# EAGLE design AS3364 waveform VCA 0402 DIL w two separate vcas v1.0-for design block (EAGLE 9.6.2)
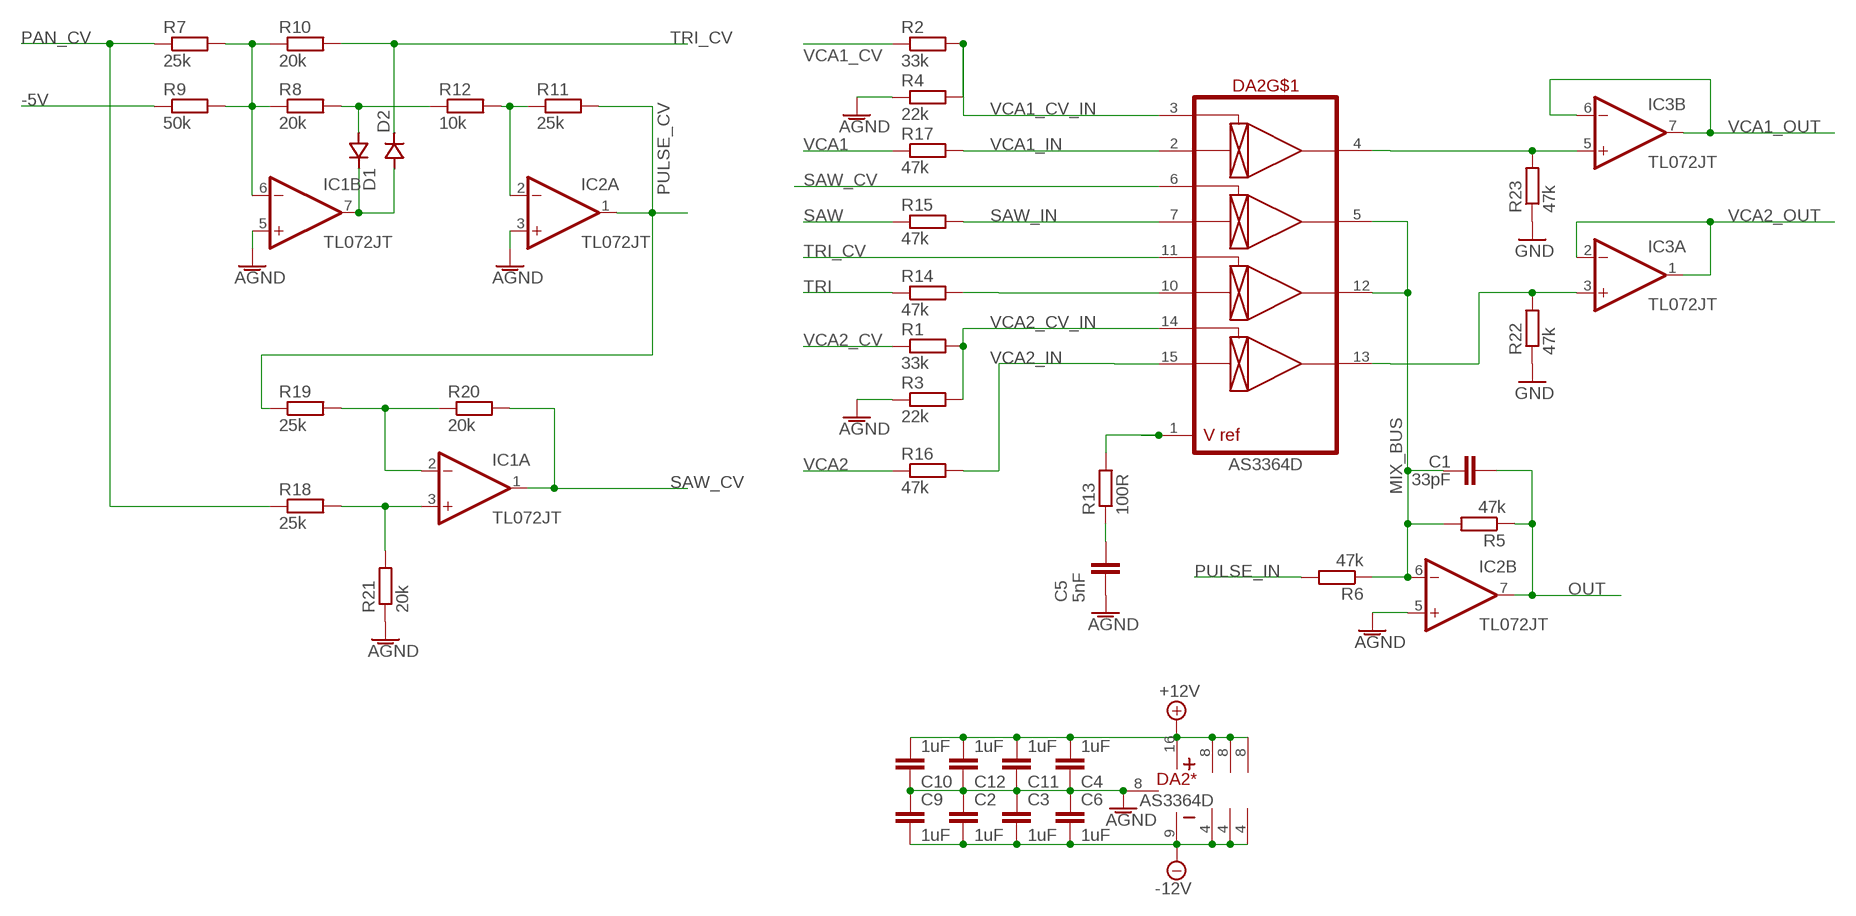
[diagram p0: schematic, sheet 1]

## Parts
C1  33pF  C-EU-J  [C0402-J]
C2  1uF  C-EU-J  [C0402-J]
C3  1uF  C-EU-J  [C0402-J]
C4  1uF  C-EU-J  [C0402-J]
C5  5nF  C-EU-J  [C0402-J]
C6  1uF  C-EU-J  [C0402-J]
C9  1uF  C-EU-J  [C0402-J]
C10  1uF  C-EU-J  [C0402-J]
C11  1uF  C-EU-J  [C0402-J]
C12  1uF  C-EU-J  [C0402-J]
D1  DIODESOD323  [SOD323J]
D2  DIODESOD323  [SOD323J]
DA2  AS3364D  [DIL16J]
IC1  TL072JT  [TSSOP8J]
IC2  TL072JT  [TSSOP8J]
IC3  TL072JT  [TSSOP8J]
R1  33k  R-EU_R0402  [R0402]
R2  33k  R-EU_R0402  [R0402]
R3  22k  R-EU_R0402  [R0402]
R4  22k  R-EU_R0402  [R0402]
R5  47k  R-EU_R0402  [R0402]
R6  47k  R-EU_R0402  [R0402]
R7  25k  R-EU_R0402  [R0402]
R8  20k  R-EU_R0402  [R0402]
R9  50k  R-EU_R0402  [R0402]
R10  20k  R-EU_R0402  [R0402]
R11  25k  R-EU_R0402  [R0402]
R12  10k  R-EU_R0402  [R0402]
R13  100R  R-EU_R0402  [R0402]
R14  47k  R-EU_R0402  [R0402]
R15  47k  R-EU_R0402  [R0402]
R16  47k  R-EU_R0402  [R0402]
R17  47k  R-EU_R0402  [R0402]
R18  25k  R-EU_R0402  [R0402]
R19  25k  R-EU_R0402  [R0402]
R20  20k  R-EU_R0402  [R0402]
R21  20k  R-EU_R0402  [R0402]
R22  47k  R-EU_R0402  [R0402]
R23  47k  R-EU_R0402  [R0402]

## Nets
+12V: C4.2 C10.2 C11.2 C12.2 DA2.16(*:V+) IC1.8(P:V+) IC2.8(P:V+) IC3.8(P:V+)
-5V: R9.1
-12V: C2.1 C3.1 C6.1 C9.1 DA2.9(*:V-) IC1.4(P:V-) IC2.4(P:V-) IC3.4(P:V-)
AGND: C2.2 C3.2 C4.1 C5.1 C6.2 C9.2 C10.1 C11.1 C12.1 DA2.8(*:GND) IC1.5(B:+IN) IC2.3(A:+IN) IC2.5(B:+IN) R3.1 R4.1 R21.1
GND: R22.1 R23.1
MIX_BUS: C1.2 DA2.5(OUT2) DA2.12(OUT3) IC2.6(B:-IN) R5.2 R6.1
N$2: DA2.1(VREF) R13.2
N$6: D1.1(C) D2.2(A) IC1.7(B:OUT)
N$8: IC1.6(B:-IN) R7.2 R8.1 R9.2 R10.1
N$11: IC1.3(A:+IN) R18.2 R21.2
N$14: C5.2 R13.1
N$15: IC1.2(A:-IN) R19.2 R20.1
N$18: IC2.2(A:-IN) R11.1 R12.2
N$19: D1.2(A) R8.2 R12.1
OUT: C1.1 IC2.7(B:OUT) R5.1
PAN_CV: R7.1 R18.1
PULSE_CV: IC2.1(A:OUT) R11.2 R19.1
PULSE_IN: R6.2
SAW: R15.1
SAW_CV: DA2.6(CV2) IC1.1(A:OUT) R20.2
SAW_IN: DA2.7(IN2) R15.2
TRI: R14.1
TRI_CV: D2.1(C) DA2.11(CV3) R10.2
TRI_IN: DA2.10(IN3) R14.2
VCA1: R17.1
VCA1_CV: R2.1
VCA1_CV_IN: DA2.3(CV1) R2.2 R4.2
VCA1_IN: DA2.2(IN1) R17.2
VCA1_OUT: IC3.6(B:-IN) IC3.7(B:OUT)
VCA1_PRE_OUT: DA2.4(OUT1) IC3.5(B:+IN) R23.2
VCA2: R16.1
VCA2_CV: R1.1
VCA2_CV_IN: DA2.14(CV4) R1.2 R3.2
VCA2_IN: DA2.15(IN4) R16.2
VCA2_OUT: IC3.1(A:OUT) IC3.2(A:-IN)
VCA2_PRE_OUT: DA2.13(OUT4) IC3.3(A:+IN) R22.2

## Library data of the parts
C1-C6 C9-C12 = joakim:C-EU-J: CAPACITOR, European symbol
D1 D2 = joakim:DIODE: DIODE; MPN: CDSOD323-T05C; OC_FARNELL: 1824860; OC_NEWARK: 79R6078
DA2 = joakim:AS3364: AS3364 quad linear VCA, CEM3360 style. CV is 0 to 2V Vcc-Vee = 26V max, so +/-12V or +15V/-9V
IC1-IC3 = joakim:TL072J: OP AMP
R1-R23 = rcl:R-EU_: RESISTOR, European symbol; SPICEPREFIX: R

## Board
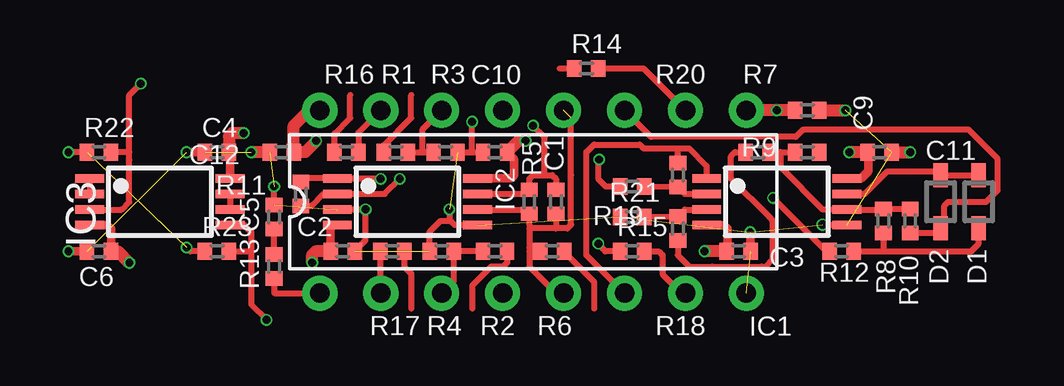
[diagram p1: board, top side]
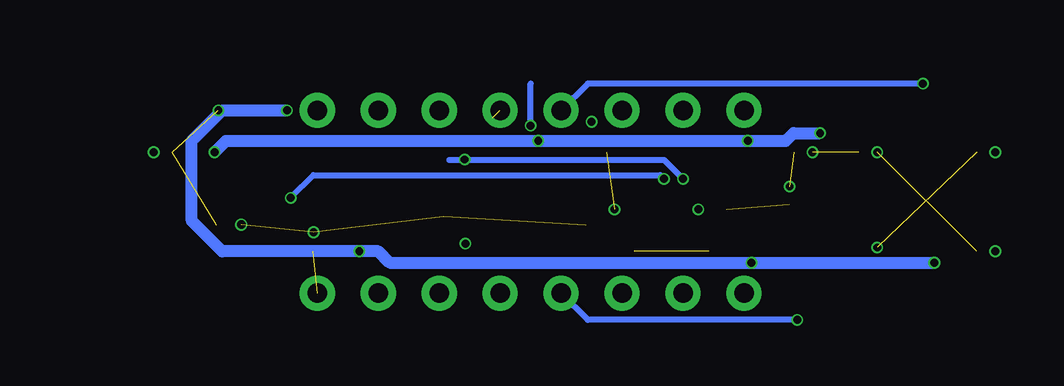
[diagram p2: board, bottom side, seen from below]

No outline drawn. Coordinates in mm, seen from the top.
Copper layers (1*16): Top 0.035mm / dielectric 1.6mm / Bottom 0.035mm
Design rules "jlcpcb-2layers": minimum track width 5mil, minimum drill 0.3mm, track to track 5mil, track to pad 5mil, pad to pad 5mil, via to via 5mil, smd to smd 5mil, copper to edge 0.2mm, drill to drill 6mil, minimum pad ring 10mil, minimum via ring 3mil, stop-mask expansion 4mil, vias tented up to drill 0mil, thermal gap 10mil

### Footprints (pad centres in the part's own frame; a part is rotated, then mirrored left to right if it is on the bottom)
C0402-J = smd 0.6 x 0.7: 1 -0.5,0; 2 0.5,0
SOD323J = smd 1 x 0.6: 1 -1.1,0; 2 1.1,0
DIL16J = drill 0.813: 1 -8.89,-3.81; 2 -6.35,-3.81; 3 -3.81,-3.81; 4 -1.27,-3.81; 5 1.27,-3.81; 6 3.81,-3.81; 7 6.35,-3.81; 8 8.89,-3.81; 9 8.89,3.81; 10 6.35,3.81; 11 3.81,3.81; 12 1.27,3.81; 13 -1.27,3.81; 14 -3.81,3.81; 15 -6.35,3.81; 16 -8.89,3.81
TSSOP8J = smd 1.2 x 0.35: 1 -2.925,0.975; 2 -2.925,0.325; 3 -2.925,-0.325; 4 -2.925,-0.975; 5 2.925,-0.975; 6 2.925,-0.325; 7 2.925,0.325; 8 2.925,0.975
R0402 = smd 0.6 x 0.7: 1 -0.5,0; 2 0.5,0

### Placement (x,y rotation side)
C1  21.27,4.76 270 top
C2  12.38,2.7 0 top
C3  28.89,2.7 0 top
C4  7.14,6.83 0 top
C5  9.53,4.13 270 top
C6  2.22,2.7 180 top
C9  31.75,8.57 0 top
C10  18.73,6.83 0 top
C11  34.77,6.83 180 top
C12  9.84,6.83 0 top
D1  38.89,4.76 270 top
D2  37.31,4.76 90 top
DA2  20.32,4.76 0 top
IC1  30.48,4.76 0 top
IC2  15.08,4.76 0 top
IC3  4.76,4.76 0 top
R1  14.61,6.83 0 top
R2  18.73,2.7 180 top
R3  16.67,6.83 180 top
R4  16.51,2.7 0 top
R5  20.16,4.76 270 top
R6  21.11,2.7 0 top
R7  29.69,6.83 0 top
R8  34.92,3.97 270 top
R9  31.75,6.83 180 top
R10  36.04,3.97 270 top
R11  10.64,5.08 90 top
R12  33.18,2.7 180 top
R13  9.53,2.06 270 top
R14  22.54,10.32 0 top
R15  24.45,2.7 0 top
R16  12.54,6.83 0 top
R17  14.45,2.7 180 top
R18  26.35,3.65 90 top
R19  24.45,5.4 0 top
R20  26.35,5.87 90 top
R21  24.45,4.13 0 top
R22  2.22,6.83 0 top
R23  7.14,2.7 0 top

### Tracks (layer width: path | path; a pad name or v marks a point on that pad's centre or on a via)
+12V  (via drill 0.33)
  Top 0.356: IC1.8 33.99,5.74 34.29,6.03 34.29,6.8 C11.2 | C4.2 7.69,6.78 IC3.8 | IC2.8 19.39,5.74 19.53,5.87 19.53,6.53 C10.2
  Top 0.508: C10.2 19.71,7.3 v20,7.3 | v11.27,7.3 11.27,7.28 10.82,6.83 C12.2 10.34,7.94 10.98,8.57 DA2.16 | C11.2 v33.5,6.83 | v8.26,7.62 7.78,7.62 7.64,7.49 C4.2
  Bottom 0.508: v33.5,6.83 33.02,7.3 v20,7.3 18.1,7.3 v11.27,7.3 9.68,7.3 9.37,7.62 v8.26,7.62
-12V  (via drill 0.33)
  Top 0.356: C2.1 11.88,3.33 11.88,3.79 IC2.4 | IC1.4 28.28,3.79 28.42,3.65 28.42,2.72 C3.1 | IC3.4 2.56,3.79 2.72,3.63 C6.1
  Top 0.508: DA2.9 C9.1 v30.48,8.57 | C2.1 11.25,2.7 11.11,2.56 v11.11,2.22 | C3.1 v27.46,2.7 | v3.49,2.22 3.02,2.7 C6.1
  Bottom 0.508: 26.67,2.7 26.19,2.22 v11.11,2.22 v3.49,2.22 | 26.67,2.7 v27.46,2.7 | 26.67,2.7 v27.46,2.7 | v27.46,2.7 33.18,2.7 34.45,3.97 34.45,7.3 33.18,8.57 v30.48,8.57
AGND  (via drill 0.33, 0.35)  (12 unrouted)
  Top 0.254: IC1.5 32.41,3.79 v32.38,3.81 | C5.1 v9.53,5.4 | IC2.5 17.05,3.79 16.83,4.01 v16.83,4.45 | IC2.3 v13.34,4.45 13.34,3.15 C2.2 | R4.1 16.01,3.52 16.46,3.97 16.83,3.97 | R3.1 17.78,6.83 | 17.78,6.83 C10.1 | 17.78,6.83 v17.78,8.1
  Top 0.356: C3.2 29.37,2.72 v29.37,3.49 | C4.1 v5.87,6.83 | C6.2 v0.95,2.7
  Top 0.508: C9.2 v33.34,8.57 | C11.1 v36.04,6.83 | C12.1 v8.57,6.83
GND  (via drill 0.33)  (1 unrouted)
  Top 0.254: R22.1 v0.95,6.83 | R23.1 6.03,2.7 v5.87,2.86
MIX_BUS  (1 unrouted)
  Top 0.254: 21.27,3.65 21.75,3.65 21.91,3.81 21.91,5.87 21.91,8.26 | 21.27,3.65 20.16,3.65 | IC2.6 19.99,4.44 R5.2 20.16,3.81 20.16,3.65 | C1.2 21.27,3.65 | 20.16,3.65 20.16,2.86 20.16,2.7 | 20.16,2.7 R6.1 | 20.16,2.7 20.16,2.06 21.27,0.95 DA2.5
N$2
  Top 0.254: DA2.1 9.53,0.95 R13.2
N$6
  Top 0.254: IC1.7 34.14,5.09 35.08,6.03 37.14,6.03 D2.2 D1.1
N$8
  Top 0.254: IC1.6 32.39,4.44 30.64,6.19 30.64,6.83 | R7.2 30.64,6.83 | 30.64,6.83 R9.2 | 33.44,4.47 IC1.6 | IC1.6 34.89,4.44 R8.1 R10.1
N$11
  Top 0.254: 27.56,4.45 IC1.3 26.64,4.44 R18.2 R21.2
N$14
  Top 0.254: R13.1 C5.2
N$15
  Top 0.254: 27.56,5.08 IC1.2 26.64,5.09 R20.1 R19.2
N$18  (via drill 0.33)
  Top 0.254: R11.1 11.09,4.58 11.6,5.09 IC2.2 14.14,5.09 v14.76,5.71 | v30.32,4.92 32.54,2.7 R12.2
  Bottom 0.254: v30.32,4.92 29.37,5.87 14.92,5.87 v14.76,5.71
N$19
  Top 0.254: R8.2 34.92,2.7 | R12.1 34.92,2.7 | D1.2 38.89,3.02 38.58,2.7 34.92,2.7
OUT  (via drill 0.33)
  Top 0.254: IC2.7 19.99,5.09 R5.1 20.16,5.71 20.32,5.87 20.8,5.87 | 20.8,5.87 21.11,5.87 21.27,5.71 C1.1 | v20.32,7.94 20.8,7.46 20.8,5.87
  Bottom 0.254: v20.32,7.94 20.32,9.68
PAN_CV
  Top 0.254: R18.1 26.35,2.54 26.83,2.06 27.78,2.06 29.84,2.06 30,2.06 30.32,2.38 30.32,3.97 30.16,4.13 28.57,5.71 28.57,6.67 28.73,6.83 R7.1
PULSE_CV  (via drill 0.33)
  Top 0.254: R11.2 10.79,5.74 IC2.1 13.95,5.74 v13.97,5.71 | R19.1 23.35,5.4 23.03,5.73 23.03,6.48 v23.07,6.52
  Bottom 0.254: v13.97,5.71 14.76,6.51 19.84,6.51 23.71,6.51 23.09,6.51 v23.07,6.52
PULSE_IN
  Top 0.254: R6.2 21.61,2.67 22.86,1.43 22.86,0.32
SAW  (via drill 0.33)
  Top 0.254: R15.1 23.34,2.7 23.02,3.02 v23.04,3.02
SAW_CV
  Top 0.254: 27.53,5.71 IC1.1 27.55,6.26 26.83,6.99 26.35,6.99 | DA2.6 22.54,2.54 22.54,6.35 22.54,6.83 22.86,7.14 24.77,7.14 24.92,6.99 26.35,6.99 | R20.2 26.35,6.99
SAW_IN
  Top 0.254: R15.2 25.56,2.7 25.72,2.54 25.72,1.75 26.51,0.95 DA2.7
TRI
  Top 0.254: 21.43,10.32 R14.1
TRI_CV
  Top 0.254: R10.2 37.11,3.47 D2.1 37.47,3.82 37.47,4.6 37.62,4.76 39.21,4.76 39.69,5.24 39.69,6.54 38.45,7.78 31.59,7.78 31.27,7.46 25.24,7.46 DA2.11
TRI_IN
  Top 0.254: R14.2 24.92,10.32 DA2.10
VCA1
  Top 0.254: R17.1 14.95,2.06 15.24,1.77 15.24,0.32
VCA1_CV
  Top 0.254: R2.1 19.23,2.22 19.07,2.06 18.57,2.06 17.78,1.27 17.78,0.32
VCA1_CV_IN
  Top 0.254: R2.2 R4.2 17.01,1.45 DA2.3
VCA1_IN
  Top 0.254: R17.2 13.95,0.98 DA2.2
VCA1_OUT
  Top 0.254: IC3.7 IC3.6
VCA1_PRE_OUT  (via drill 0.33)
  Top 0.254: 7.71,3.81 IC3.5 8.28,3.79 8.57,3.49 8.57,2.7 | 8.57,2.7 8.57,0.48 v9.21,-0.16 | R23.2 8.57,2.7
  Bottom 0.254: DA2.4 17.94,-0.16 v9.21,-0.16
VCA2
  Top 0.254: R16.1 12.04,7.6 12.7,8.26 12.7,9.21
VCA2_CV
  Top 0.254: R1.1 14.11,7.12 15.24,8.26 15.24,9.21
VCA2_CV_IN
  Top 0.254: R1.2 15.72,6.83 | 15.72,6.83 15.88,6.83 R3.2 | 15.72,6.83 15.72,7.78 DA2.14
VCA2_IN
  Top 0.254: DA2.15 13.04,7.64 R16.2
VCA2_OUT
  Top 0.254: IC3.1 IC3.2
VCA2_PRE_OUT  (via drill 0.33)
  Top 0.254: IC3.3 3.17,4.44 3.49,4.76 3.49,6.51 | 3.49,6.51 3.49,6.83 R22.2 | 3.49,6.51 3.49,9.21 v3.97,9.68
  Bottom 0.254: v3.97,9.68 17.94,9.68 DA2.13